# Altium schematic sheet ETHERNET.SchDoc
size B; SheetNumber: 3; SheetTotal: 5
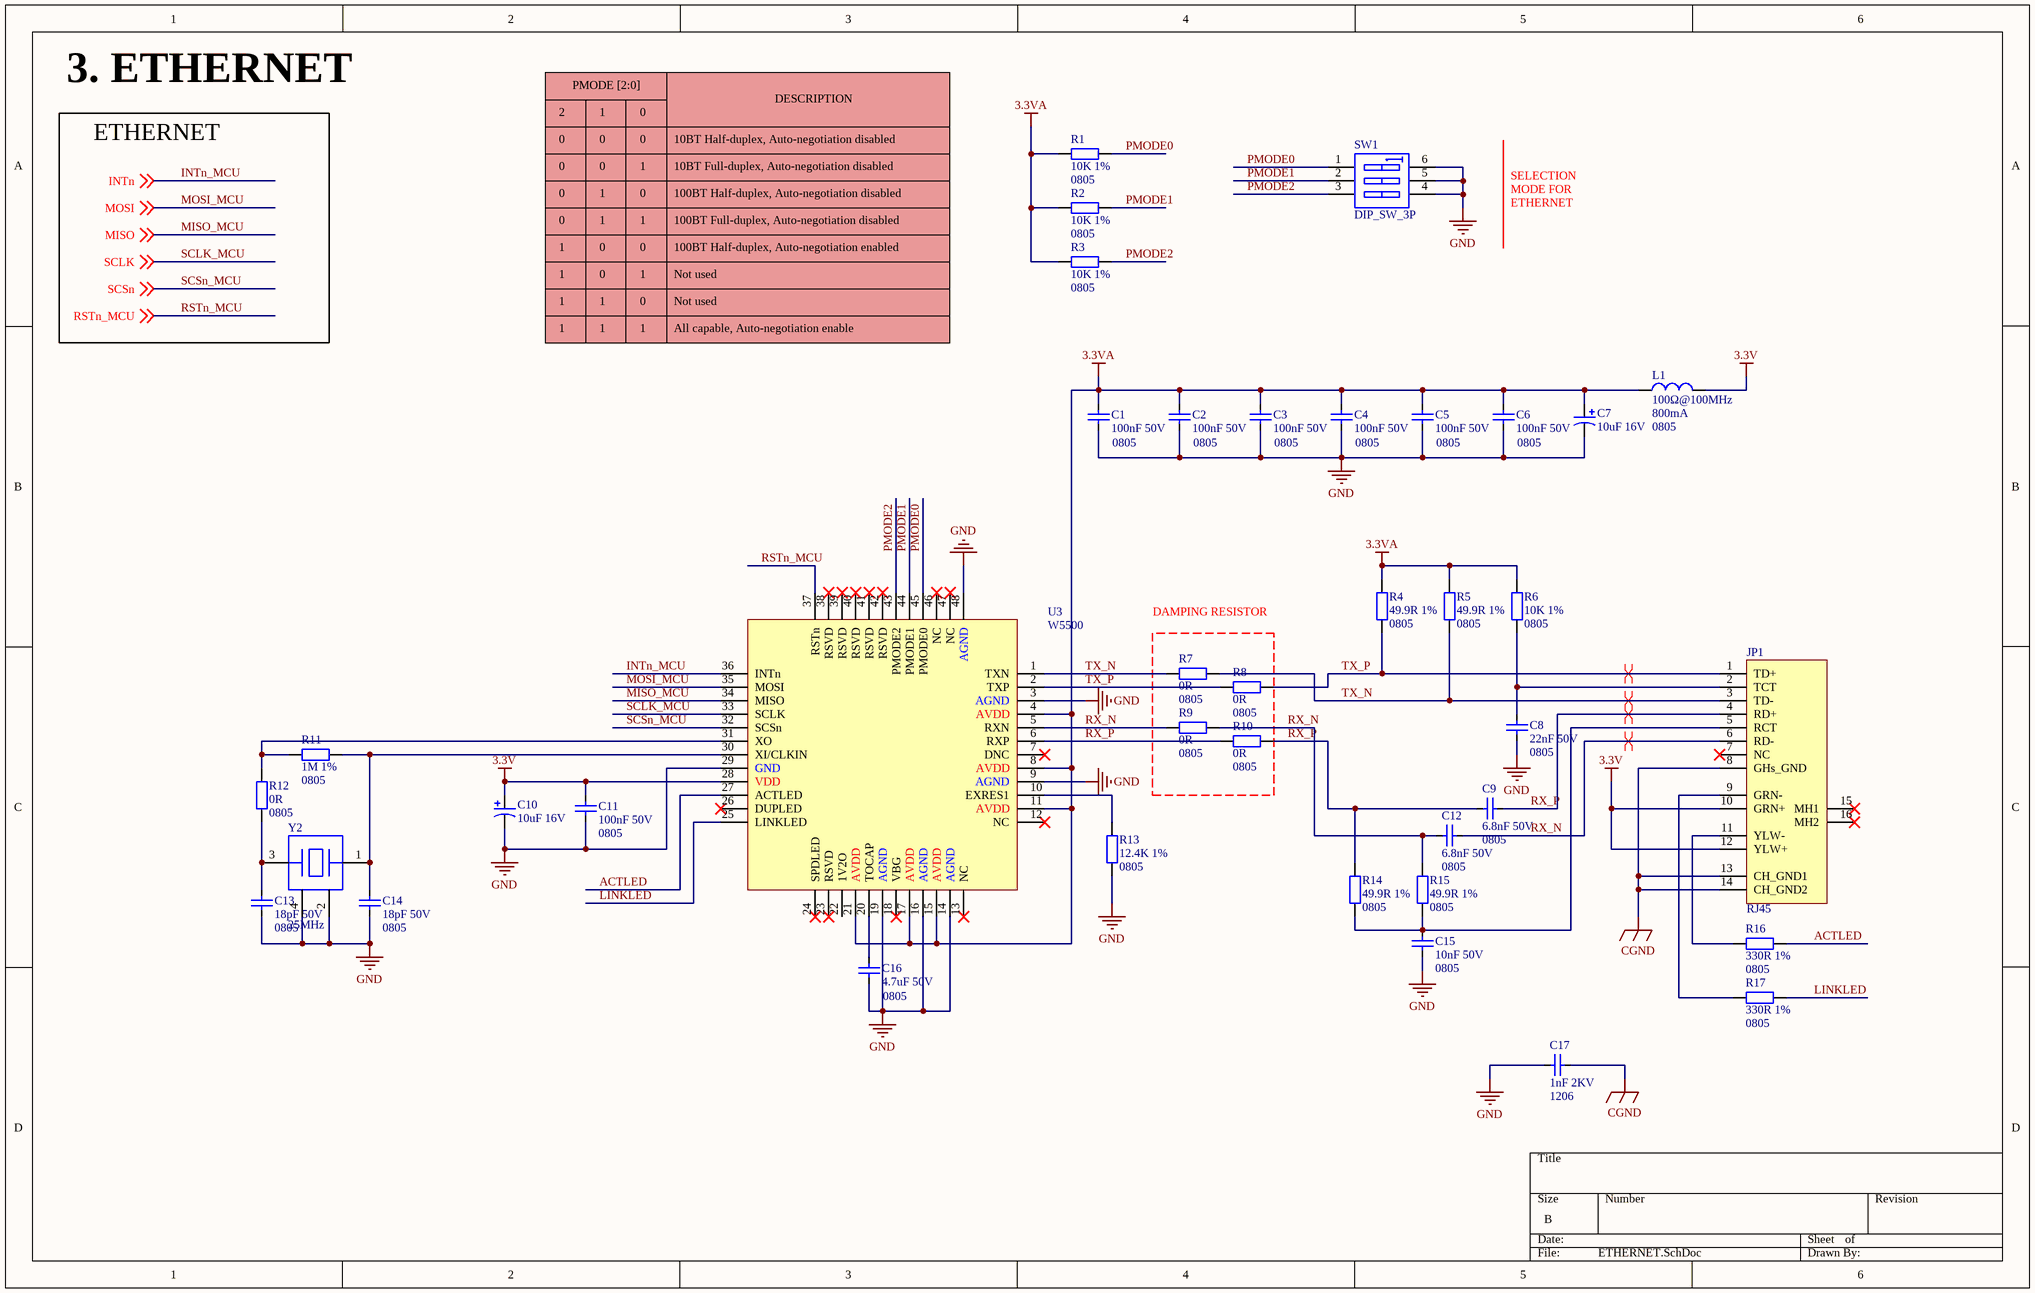
[diagram p0: ETHERNET.SchDoc]

## Parts
C1  100nF 50V  Size: 0805  [CAP_SMD_0805]
C2  100nF 50V  Size: 0805  [CAP_SMD_0805]
C3  100nF 50V  Size: 0805  [CAP_SMD_0805]
C4  100nF 50V  Size: 0805  [CAP_SMD_0805]
C5  100nF 50V  Size: 0805  [CAP_SMD_0805]
C6  100nF 50V  Size: 0805  [CAP_SMD_0805]
C7  10uF 16V  [CAP-ALU-SMD-C]
C8  22nF 50V  Size: 0805  [CAP_SMD_0805]
C9  6.8nF 50V  Size: 0805  [CAP_SMD_0805]
C10  10uF 16V  [CAP-ALU-SMD-C]
C11  100nF 50V  Size: 0805  [CAP_SMD_0805]
C12  6.8nF 50V  Size: 0805  [CAP_SMD_0805]
C13  18pF 50V  Size: 0805  [CAP_SMD_0805]
C14  18pF 50V  Size: 0805  [CAP_SMD_0805]
C15  10nF 50V  Size: 0805  [CAP_SMD_0805]
C16  4.7uF 50V  Size: 0805  [CAP_SMD_0805]
C17  1nF 2KV  Size: 1206  [CAP_SMD_0805]
JP1  RJ45  [RJ 45]
L1  Impedance @ Frequency: 100Ω@100MHz  Current: 800mA  Size: 0805  [FB_0805]  (hidden comment: 100Ohms 100Mhz)
R1  10K 1%  Size: 0805  [RES_SMD_0805]
R2  10K 1%  Size: 0805  [RES_SMD_0805]
R3  10K 1%  Size: 0805  [RES_SMD_0805]
R4  49.9R 1%  Size: 0805  [RES_SMD_0805]
R5  49.9R 1%  Size: 0805  [RES_SMD_0805]
R6  10K 1%  Size: 0805  [RES_SMD_0805]
R7  0R  Size: 0805  [RES_SMD_0805]
R8  0R  Size: 0805  [RES_SMD_0805]
R9  0R  Size: 0805  [RES_SMD_0805]
R10  0R  Size: 0805  [RES_SMD_0805]
R11  1M 1%  Size: 0805  [RES_SMD_0805]
R12  0R  Size: 0805  [RES_SMD_0805]
R13  12.4K 1%  Size: 0805  [RES_SMD_0805]
R14  49.9R 1%  Size: 0805  [RES_SMD_0805]
R15  49.9R 1%  Size: 0805  [RES_SMD_0805]
R16  330R 1%  Size: 0805  [RES_SMD_0805]
R17  330R 1%  Size: 0805  [RES_SMD_0805]
SW1  DIP_SW_3P  [DIPSWITCH3]
U3  W5500  [LQFP 48]
Y2  25MHz  [SMD-3225_4P]

## Blocks framed on the sheet
DAMPING RESISTOR: R7-R10

## Nets
3.3V: C10.1 C11.2 JP1.10(GRN+) JP1.12(YLW+) L1.2 U3.28(VDD)
3.3VA: C1.2 C2.2 C3.2 C4.2 C5.2 C6.2 C7.1 L1.1 R1.2 R2.2 R3.2 R4.2 R5.2 R6.2 U3.4(AVDD) U3.8(AVDD) U3.11(AVDD) U3.15(AVDD) U3.17(AVDD) U3.21(AVDD)
CGND: C17.2 JP1.8(GHs_GND) JP1.13(CH_GND1) JP1.14(CH_GND2)
GND: C1.1 C2.1 C3.1 C4.1 C5.1 C6.1 C7.2 C8.1 C10.2 C11.1 C13.1 C14.1 C15.1 C16.1 C17.1 R13.1 SW1.4(B3) SW1.5(B2) SW1.6(B1) U3.3(AGND) U3.9(AGND) U3.14(AGND) U3.16(AGND) U3.19(AGND) U3.29(GND) U3.48(AGND) Y2.2 Y2.4
ACTLED: R16.2 U3.27(ACTLED)
INTn_MCU: U3.36(INTn) ; off-sheet INTn  [also labelled INTn]
LINKLED: R17.2 U3.25(LINKLED)
MISO_MCU: U3.34(MISO) ; off-sheet MISO  [also labelled MISO]
MOSI_MCU: U3.35(MOSI) ; off-sheet MOSI  [also labelled MOSI]
PMODE0: R1.1 SW1.1(A1) U3.45(PMODE0)
PMODE1: R2.1 SW1.2(A2) U3.44(PMODE1)
PMODE2: R3.1 SW1.3(A3) U3.43(PMODE2)
RSTn_MCU: U3.37(RSTn) ; off-sheet RSTn_MCU
RX_N: C12.1 C12.2 JP1.6(RD-) R9.1 R9.2 R15.2 U3.5(RXN)
RX_P: C9.1 C9.2 JP1.4(RD+) R10.1 R10.2 R14.2 U3.6(RXP)
SCLK_MCU: U3.33(SCLK) ; off-sheet SCLK  [also labelled SCLK]
SCSn_MCU: U3.32(SCSn) ; off-sheet SCSn  [also labelled SCSn]
TX_N: JP1.3(TD-) R5.1 R7.1 R7.2 U3.1(TXN)
TX_P: JP1.1(TD+) R4.1 R8.1 R8.2 U3.2(TXP)
NetC8_2: C8.2 JP1.2(TCT) R6.1
NetC13_2: C13.2 R12.1 Y2.3
NetC14_2: C14.2 R11.2 U3.30(XI/CLKIN) Y2.1
NetC15_2: C15.2 JP1.5(RCT) R14.1 R15.1
NetC16_2: C16.2 U3.20(TOCAP)
NetJP1_9: JP1.9(GRN-) R17.1
NetJP1_11: JP1.11(YLW-) R16.1
NetR11_1: R11.1 R12.2 U3.31(XO)
NetR13_2: R13.2 U3.10(EXRES1)

Not connected (* = marked no-connect by the designer): JP1 7(NC)* 15(MH1)* 16(MH2)*; U3 7(DNC)* 12(NC)* 13(NC)* 18(VBG)* 22(1V2O) 23(RSVD)* 24(SPDLED)* 26(DUPLED)* 38(RSVD)* 39(RSVD)* 40(RSVD)* 41(RSVD)* 42(RSVD)* 46(NC)* 47(NC)*

## Layout directives
differential pair: RX_N, RX_P, TX_N, TX_P

## Notes on the sheet
- 3. ETHERNET
- PMODE [2:0]
- DESCRIPTION
- ETHERNET
- 2
- 0
- 1
- 10BT Half-duplex, Auto-negotiation disabled
- 10BT Full-duplex, Auto-negotiation disabled
- 100BT Half-duplex, Auto-negotiation disabled
- 100BT Full-duplex, Auto-negotiation disabled
- SELECTION MODE FOR ETHERNET
- 100BT Half-duplex, Auto-negotiation enabled
- Not used
- All capable, Auto-negotiation enable

## Library data of the parts
C1-C6 C11 = C0805_MLCC_100nF_50V: 0.1 µF ±10% 50V Ceramic Capacitor X7R 0805 (2012 Metric); Manufacturer: YAGEO; Manufacture Part Number: CC0805KRX7R9BB104; Packaging: Cut Tape (CT); Link: https://www.digikey.cn/en/products/detail/yageo/CC0805KRX7R9BB104/302874; Price: $0.10
C7 C10 = C_ALU_10uF_16V: 10 µF 16 V Aluminum - Polymer Capacitors Radial, Can - SMD 30mOhm 2000 Hrs @ 105°C; Manufacturer: Würth Elektronik; Manufacture Part Number: 875105359001; Packaging: Cut Tape (CT); Link: https://www.digikey.cn/en/products/detail/w%C3%BCrth-elektronik/875105359001/5147580; Price: $0.51; Size: C
C8 = C0805_MLCC_22nF_50V: 0.022 µF ±5% 50V Ceramic Capacitor C0G, NP0 0805 (2012 Metric); Manufacturer: TDK Corporation; Manufacture Part Number: CGA4J2C0G1H223J125AA; Packaging: Cut Tape (CT); Link: https://www.digikey.cn/en/products/detail/tdk-corporation/CGA4J2C0G1H223J125AA/2672842; Price: $0.30
C9 C12 = C0805_MLCC_6.8nF_50V: 6800 pF ±10% 50V Ceramic Capacitor X7R 0805 (2012 Metric); Manufacturer: KEMET; Manufacture Part Number: C0805C682K5RAC7800; Packaging: Cut Tape (CT); Link: https://www.digikey.cn/en/products/detail/kemet/C0805C682K5RAC7800/411156; Price: $0.10
C13 C14 = C0805_MLCC_18pF_50V: Multilayer Ceramic Capacitors MLCC - SMD/SMT 50V 18pF C0G 0805 1%; Manufacturer: KEMET; Manufacture Part Number: C0805C180F5GACTU; Packaging: Cut Tape (CT); Link: https://www.mouser.vn/ProductDetail/KEMET/C0805C180F5GACTU?qs=sGAEpiMZZMsh%252B1woXyUXj2jXeRYF1Ky29I58L2KXMTM%3D; Price: $0.68
C15 = C0805_MLCC_10nF_50V: 10000 pF ±10% 50V Ceramic Capacitor X7R 0805 (2012 Metric); Manufacturer: Samsung Electro-Mechanics; Manufacture Part Number: CL21B103KBANNNC; Packaging: Cut Tape (CT); Link: https://www.digikey.cn/en/products/detail/samsung-electro-mechanics/CL21B103KBANNNC/3886673; Price: $0.10
C16 = C0805_MLCC_4.7uF_50V: 4.7 µF ±10% 50V Ceramic Capacitor X5R 0805 (2012 Metric); Manufacturer: Samsung Electro-Mechanics; Manufacture Part Number: CL21A475KBQNNNE; Packaging: Cut Tape (CT); Link: https://www.digikey.cn/en/products/detail/samsung-electro-mechanics/CL21A475KBQNNNE/3886906; Price: $0.23
C17 = C1206_MLCC_1nF_2KV: 1000 pF ±5% 2000V (2kV) Ceramic Capacitor X7R 1206 (3216 Metric); Manufacturer: YAGEO; Manufacture Part Number: CC1206JKX7RDBB102; Packaging: Cut Tape (CT); Link: https://www.digikey.cn/en/products/detail/yageo/CC1206JKX7RDBB102/5884438; Price: $0.28
JP1 = RJ45: 1 Port RJ45Through Hole 10/100 Base-T, AutoMDIX; Manufacturer: WIZnet; Manufacture Part Number: 1278-1052-ND; Packaging: Bulk; Link: https://www.digikey.com/en/products/detail/wiznet/j1b1211ccd/7604176; Price: $3.83
L1 = FR_100Ohms_100Mhz: Manufacturer: TAI-TECH; Manufacture Part Number: FCM2012KF-101T08; Link: https://jlcpcb.com/partdetail/taitech-FCM2012KF101T08/C304250; Price: $0.0064
R1-R3 R6 = R0805_10K: 10 kOhms ±1% 0.125W, 1/8W Chip Resistor 0805 (2012 Metric) Moisture Resistant Thick Film; Manufacturer: YAGEO; Manufacture Part Number: RC0805FR-0710KL; Packaging: Cut Tape (CT); Price: $0.10; Link: https://www.digikey.cn/en/products/detail/yageo/RC0805FR-0710KL/727535
R4 R5 R14 R15 = R0805_49.9R: 49.9 Ohms ±1% 0.125W, 1/8W Chip Resistor 0805 (2012 Metric) Automotive AEC-Q200 Thick Film; Manufacturer: Stackpole Electronics Inc; Manufacture Part Number: RMCF0805FT49R9; Packaging: Cut Tape (CT); Link: https://www.digikey.com/en/products/detail/stackpole-electronics-inc/RMCF0805FT49R9/1760281; Price: $0.10
R7-R10 R12 = R0805_0R: 0 Ohms Jumper Chip Resistor 0805 (2012 Metric) Automotive AEC-Q200 Thick Film; Manufacturer: Vishay Dale; Manufacture Part Number: CRCW08050000Z0EA; Packaging: Cut Tape (CT); Link: https://www.digikey.cn/en/products/detail/vishay-dale/CRCW08050000Z0EA/1175125; Price: $0.10
R11 = R0805_1M: 1 MOhms ±1% 0.125W, 1/8W Chip Resistor 0805 (2012 Metric) Automotive AEC-Q200 Thick Film; Manufacturer: Stackpole Electronics Inc; Manufacture Part Number: RMCF0805FT1M00; Packaging: Cut Tape (CT); Link: https://www.digikey.com/en/products/detail/stackpole-electronics-inc/RMCF0805FT1M00/1760080; Price: $0.10
R13 = R0805_12.4K: 12.4 kOhms ±1% 0.125W, 1/8W Chip Resistor 0805 (2012 Metric) Automotive AEC-Q200 Thick Film; Manufacturer: Stackpole Electronics Inc; Manufacture Part Number: RMCF0805FT12K4; Packaging: Cut Tape (CT); Link: https://www.digikey.com/en/products/detail/stackpole-electronics-inc/RMCF0805FT12K4/1760664; Price: $0.10
R16 R17 = R0805_330R: 330 Ohms ±1% 0.125W, 1/8W Chip Resistor 0805 (2012 Metric) Automotive AEC-Q200 Thick Film; Manufacturer: Stackpole Electronics Inc; Manufacture Part Number: RMCF0805FT330R; Packaging: Cut Tape (CT); Link: https://www.digikey.cn/en/products/detail/stackpole-electronics-inc/RMCF0805FT330R/1760484; Price: $0.10
SW1 = DIP_SW_3P: Dip Switch SPST 3 Position Through Hole Slide (Standard) Actuator 25mA 24VDC; Manufacturer: CIT Relay and Switch; Manufacture Part Number: KG03E; Packaging: Tube; Link: https://www.digikey.cn/en/products/detail/cit-relay-and-switch/KG03E/15294176; Price: $0.65
U3 = W5500: Ethernet ICs 3in1 Enet Controller TCP/IP +MAC+PHY; Manufacturer: WIZnet; Manufacture Part Number: W5500; Packaging: Cut Tape; Link: https://www.mouser.vn/ProductDetail/WIZnet/W5500?qs=2vh%252B45pPFtzthUpYPd4pqA%3D%3D; Price: $3.67
Y2 = C3225_25MHz: 3.3V HCMOS ±4.6ppm 25MHz SMD3225-4P Temperature Compensated Crystal Oscillators (TCXOs) ROHS; Manufacturer: HCI; Manufacture Part Number: TC32H4-25.000-33GNDTNL; Packaging: Cut Tape; ComponentLink1Description: New link; ComponentLink1URL: *; Link: https://www.lcsc.com/product-detail/Temperature-Compensated-span-style-background-color-ff0-Crystal-span-Oscillators-TCXOs_HCI-TC32H4-25-000-33GNDTNL_C5119013.html; Price: $ 3.52